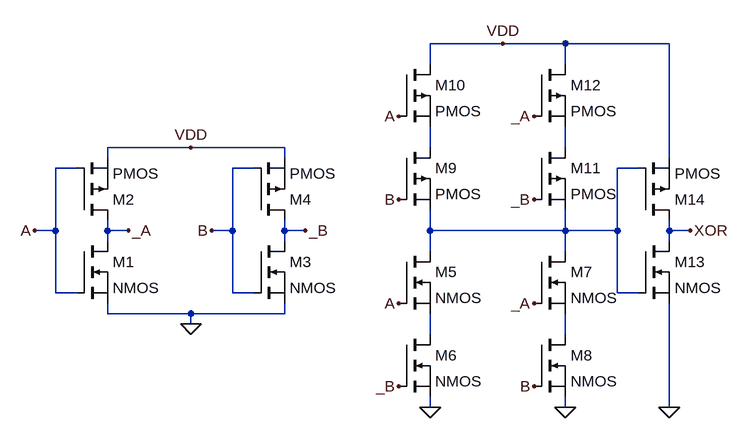
[diagram p0: schematic Xor.asc]
Xor.asc, the LTspice schematic file:
Version 4
SHEET 1 1348 680
WIRE 960 -80 848 -80
WIRE 1056 -80 960 -80
WIRE 1216 -80 1056 -80
WIRE 848 -48 848 -80
WIRE 1056 -48 1056 -80
WIRE 480 80 352 80
WIRE 624 80 480 80
WIRE 848 80 848 48
WIRE 1056 80 1056 48
WIRE 352 96 352 80
WIRE 624 96 624 80
WIRE 1216 96 1216 -80
WIRE 304 112 272 112
WIRE 576 112 544 112
WIRE 1168 112 1136 112
WIRE 272 208 272 112
WIRE 272 208 240 208
WIRE 352 208 352 192
WIRE 384 208 352 208
WIRE 544 208 544 112
WIRE 544 208 512 208
WIRE 624 208 624 192
WIRE 656 208 624 208
WIRE 848 208 848 176
WIRE 1056 208 1056 176
WIRE 1056 208 848 208
WIRE 1136 208 1136 112
WIRE 1136 208 1056 208
WIRE 1216 208 1216 192
WIRE 1248 208 1216 208
WIRE 352 224 352 208
WIRE 624 224 624 208
WIRE 1216 224 1216 208
WIRE 848 240 848 208
WIRE 1056 240 1056 208
WIRE 272 304 272 208
WIRE 304 304 272 304
WIRE 544 304 544 208
WIRE 576 304 544 304
WIRE 1136 304 1136 208
WIRE 1168 304 1136 304
WIRE 352 336 352 320
WIRE 480 336 352 336
WIRE 624 336 624 320
WIRE 624 336 480 336
WIRE 480 352 480 336
WIRE 848 368 848 336
WIRE 1056 368 1056 336
WIRE 848 480 848 464
WIRE 1056 480 1056 464
WIRE 1216 480 1216 320
FLAG 240 208 A
FLAG 384 208 _A
FLAG 512 208 B
FLAG 656 208 _B
FLAG 480 352 0
FLAG 480 80 VDD
FLAG 1056 480 0
FLAG 848 480 0
FLAG 960 -80 VDD
FLAG 1216 480 0
FLAG 800 320 A
FLAG 800 32 A
FLAG 800 160 B
FLAG 1008 448 B
FLAG 1008 32 _A
FLAG 1008 320 _A
FLAG 1008 160 _B
FLAG 800 448 _B
FLAG 1248 208 XOR
SYMBOL nmos 304 224 R0
SYMATTR InstName M1
SYMBOL pmos 304 192 M180
SYMATTR InstName M2
SYMBOL nmos 576 224 R0
SYMATTR InstName M3
SYMBOL pmos 576 192 M180
SYMATTR InstName M4
SYMBOL nmos 800 240 R0
SYMATTR InstName M5
SYMBOL nmos 800 368 R0
SYMATTR InstName M6
SYMBOL nmos 1008 240 R0
SYMATTR InstName M7
SYMBOL nmos 1008 368 R0
SYMATTR InstName M8
SYMBOL pmos 800 80 R0
SYMATTR InstName M9
SYMBOL pmos 800 -48 R0
SYMATTR InstName M10
SYMBOL pmos 1008 80 R0
SYMATTR InstName M11
SYMBOL pmos 1008 -48 R0
SYMATTR InstName M12
SYMBOL nmos 1168 224 R0
SYMATTR InstName M13
SYMBOL pmos 1168 192 M180
SYMATTR InstName M14

The netlist it stands for:
* Xor.asc
M1 _A A 0 0 NMOS
M2 _A A VDD VDD PMOS
M3 _B B 0 0 NMOS
M4 _B B VDD VDD PMOS
M5 N003 A N004 N004 NMOS
M6 N004 _B 0 0 NMOS
M7 N003 _A N005 N005 NMOS
M8 N005 B 0 0 NMOS
M9 N001 B N003 N003 PMOS
M10 VDD A N001 N001 PMOS
M11 N002 _B N003 N003 PMOS
M12 VDD _A N002 N002 PMOS
M13 XOR N003 0 0 NMOS
M14 XOR N003 VDD VDD PMOS
.model NMOS NMOS
.model PMOS PMOS
.lib standard.mos
.backanno
.end